# EasyEDA schematic SCH_Auto-tune-FM-reciever_2024-02-23.json
TITLE: Sheet_1; REV: 1.0; Date: 2024-02-21; Sheet: 1/1; Company: Your Company
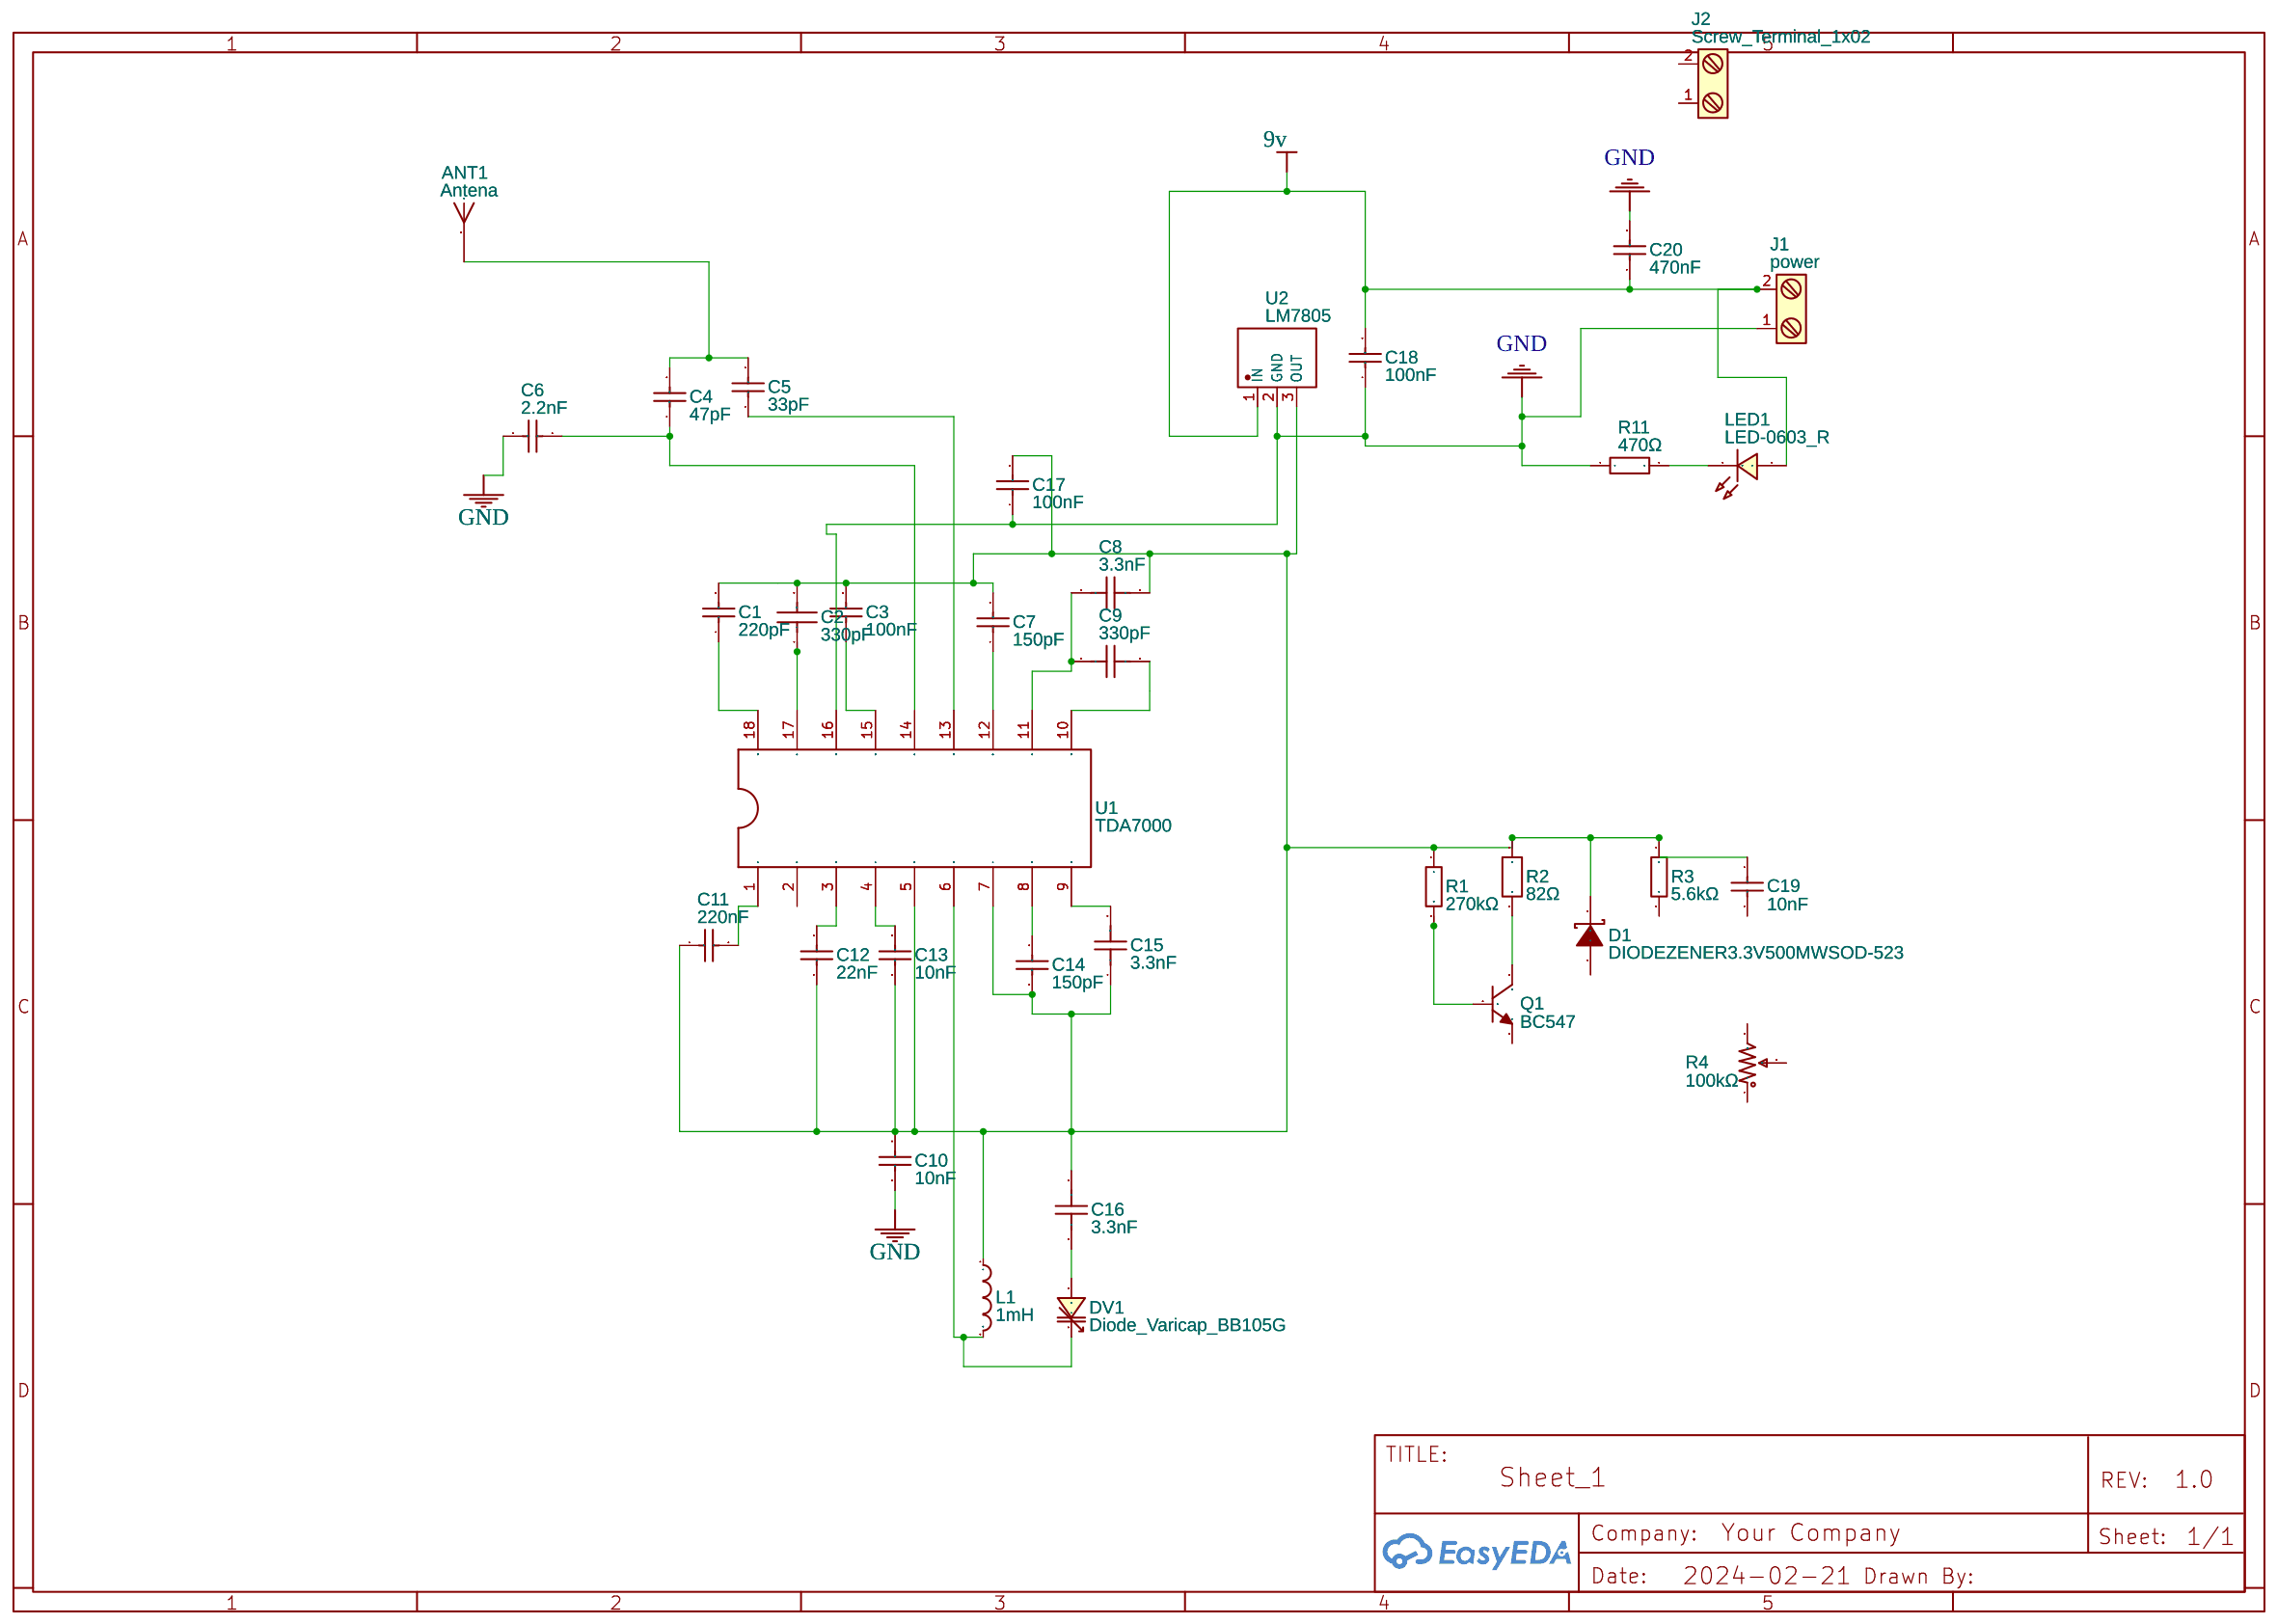
[diagram p0: schematic sheet]

## Parts
ANT1  Antena  [ANTENA_1P]
C1  220pF  [C0603]
C2  330pF  [C0402]
C3  100nF  [C1206]
C4  47pF  [C0603]
C5  33pF  [C0603]
C6  2.2nF  [C0805]
C7  150pF  [C0603]
C8  3.3nF  [C0402]
C9  330pF  [C0603]
C10  10nF  [C0402]
C11  220nF  [C0805]
C12  22nF  [C0805]
C13  10nF  [C0402]
C14  150pF  [C0603]
C15  3.3nF  [C0402]
C16  3.3nF  [C0402]
C17  100nF  [C1206]
C18  100nF  [C1206]
C19  10nF  [C0402]
C20  470nF  [C0603]
D1  DIODEZENER3.3V500MWSOD-523  [SOD-523_L1.2-W0.8-LS1.6-RD]
DV1  Diode_Varicap_BB105G  [DIODE_VARICAP_BB105G]
J1  power
J2  Screw_Terminal_1x02
L1  1mH  [IND-SMD_L4.0-W4.0]
LED1  LED-0603_R  [LED0603_RED]
Q1  BC547  [TO-92-3_L4.5-W3.5-P1.27-L]
R1  270kΩ  [R0402]
R2  82Ω  [R1206]
R3  5.6kΩ  [RES-TH_BD2.4-L6.3-P10.30-D0.6]
R4  100kΩ  [RES-ADJ-TH_3P-L9.6-W4.8-P2.50-R]
R11  470Ω  [R0402]
U1  TDA7000  [TDA7000]
U2  LM7805  [TO-220-3_L10.0-W4.5-P2.54-L]

## Library data of the parts
ANT1 = Antena: Contributor: kylevaughan; Mounted: Yes; Manufacturer Part: ?
C1 = CL10B221KB8NNNC: Supplier: LCSC; Manufacturer: SAMSUNG(三星); Supplier Part: C1603; JLCPCB Part Class: Basic Part
C2 = CL05C331JB5NNNC: Supplier: LCSC; Manufacturer: SAMSUNG(三星); Supplier Part: C13533; JLCPCB Part Class: Extended Part
C3 C17 C18 = CL31B104KBCNNNC: Supplier: LCSC; Manufacturer: SAMSUNG(三星); Supplier Part: C24497; JLCPCB Part Class: Basic Part
C4 = CL10C470JB8NNNC: Supplier: LCSC; Manufacturer: SAMSUNG(三星); Supplier Part: C1671; JLCPCB Part Class: Basic Part
C5 = CL10C330JB8NNNC: Supplier: LCSC; Manufacturer: SAMSUNG(三星); Supplier Part: C1663; JLCPCB Part Class: Basic Part
C6 = CL21B222KBANNNC: Supplier: LCSC; Manufacturer: SAMSUNG(三星); Supplier Part: C1728; JLCPCB Part Class: Extended Part
C7 C14 = CL10C151JB8NNNC: Supplier: LCSC; Manufacturer: SAMSUNG(三星); Supplier Part: C37298; JLCPCB Part Class: Extended Part
C8 C15 C16 = CL05B332KB5NNNC: Supplier: LCSC; Manufacturer: SAMSUNG(三星); Supplier Part: C26404; JLCPCB Part Class: Extended Part
C9 = CL10B331KB8NNNC: Supplier: LCSC; Manufacturer: SAMSUNG(三星); Supplier Part: C85310; JLCPCB Part Class: Extended Part
C10 C13 C19 = CL05B103KB5NNNC: Supplier: LCSC; Manufacturer: SAMSUNG(三星); Supplier Part: C15195; JLCPCB Part Class: Basic Part
C11 = CL21B224KBFNNNE: Supplier: LCSC; Manufacturer: SAMSUNG(三星); Supplier Part: C5378; JLCPCB Part Class: Basic Part
C12 = CL21B223KBANNNC: Supplier: LCSC; Manufacturer: SAMSUNG(三星); Supplier Part: C1729; JLCPCB Part Class: Basic Part
C20 = C1608X5R1C474KT000N: Supplier: LCSC; Manufacturer: TDK; Supplier Part: C76613; JLCPCB Part Class: Extended Part
D1 = DIODEZENER3.3V500MWSOD-523: Contributor: lcsc; Supplier: LCSC; Supplier Part: C9900023612; Manufacturer: null; JLCPCB Part Class: Extended Part
DV1 = Diode_Varicap_BB105G: High Conductance Fast Diode; Contributor: tontondadou
J1 J2 = Screw_Terminal_1x02: Contributor: KiCAD; license: https://www.gnu.org/licenses/lgpl-2.1.html
L1 = CKCS4030-1MH/M: Contributor: LCSC; Supplier: LCSC; Supplier Part: C354594; Manufacturer: CENKER(岑科); Manufacturer Part: CKCS4030-1mH/M; JLCPCB Part Class: Extended Part
LED1 = LED-0603_R: Manufacturer: EVERLIGHT(台湾亿光); Manufacturer Part: 19-217/R6C-AL1M2VY/3T; Supplier Part: C72044; Supplier: LCSC; Contributor: LCEDA_01
Q1 = BC547: Contributor: LCSC; Supplier: LCSC; Supplier Part: C2910381; Manufacturer: CJ(江苏长电/长晶); JLCPCB Part Class: Extended Part
R1 = RCT02270KJLF: Contributor: LCSC; Supplier: LCSC; Manufacturer: HKR; Supplier Part: C174235; JLCPCB Part Class: Extended Part
R2 = CR-06JA7---82R: Contributor: LCSC; Supplier: LCSC; Supplier Part: C408822; Manufacturer: Viking(光颉); JLCPCB Part Class: Extended Part
R3 = MFR-25FTE52-5K6: Contributor: LCSC; Supplier: LCSC; Supplier Part: C173035; Manufacturer: YAGEO(国巨); JLCPCB Part Class: Extended Part
R4 = CT-94EX104: Contributor: lcsc; Supplier: LCSC; Supplier Part: C2921734; Manufacturer: NIDEC(尼得科); JLCPCB Part Class: Extended Part
R11 = RC0402FR-07470RL: Supplier: LCSC; Manufacturer: YAGEO(国巨); Supplier Part: C114877; JLCPCB Part Class: Extended Part
U1 = TDA7000: Contributor: ivokovacic
U2 = LM7805: Contributor: LCSC; Supplier: LCSC; Supplier Part: C845394; Manufacturer: TF(拓锋); JLCPCB Part Class: Extended Part

## Nets
9v: C18.2 C20.1 J1.2 LED1.1 U2.1(IN)
GND: C6.1 C10.1 C17.1 C18.1 C20.2 J1.1 R11.1 U1.16 U2.2(GND)
Net-(ANT1-1): ANT1.1 C4.2 C5.2
Net-(C1-1): C1.1 U1.18
Net-(C1-2): C1.2 C2.2 C3.2 C7.2 C8.2 C10.2 C11.1 C12.1 C13.1 C14.1 C15.1 C16.2 C17.2 C19.1 D1.1(K) L1.1 R1.1 R2.1 R3.1 U1.5 U1.7 U2.3(OUT)
Net-(C2-1): C2.1 U1.17
Net-(C3-1): C3.1 U1.15
Net-(C4-1): C4.1 C6.2 U1.14
Net-(C5-1): C5.1 U1.13
Net-(C7-1): C7.1 U1.12
Net-(C8-1): C8.1 C9.1 U1.11
Net-(C9-2): C9.2 U1.10
Net-(C11-2): C11.2 U1.1
Net-(C12-2): C12.2 U1.3
Net-(C13-2): C13.2 U1.4
Net-(C14-2): C14.2 U1.8
Net-(C15-2): C15.2 U1.9
Net-(C16-1): C16.1 DV1.1(A)
Net-(DV1-2): DV1.2(K) L1.2 U1.6
Net-(LED1-2): LED1.2 R11.2
Net-(Q1-1): Q1.1(C) R2.2
Net-(Q1-2): Q1.2(B) R1.2

Not connected (* = marked no-connect by the designer): C19 2; D1 2(A); J2 1 2; Q1 3(E); R3 2; R4 1 2 3; U1 2
